# EAGLE schematic shieldRelayV2 (EAGLE 9.6.2)

## Sheet 1 of 3
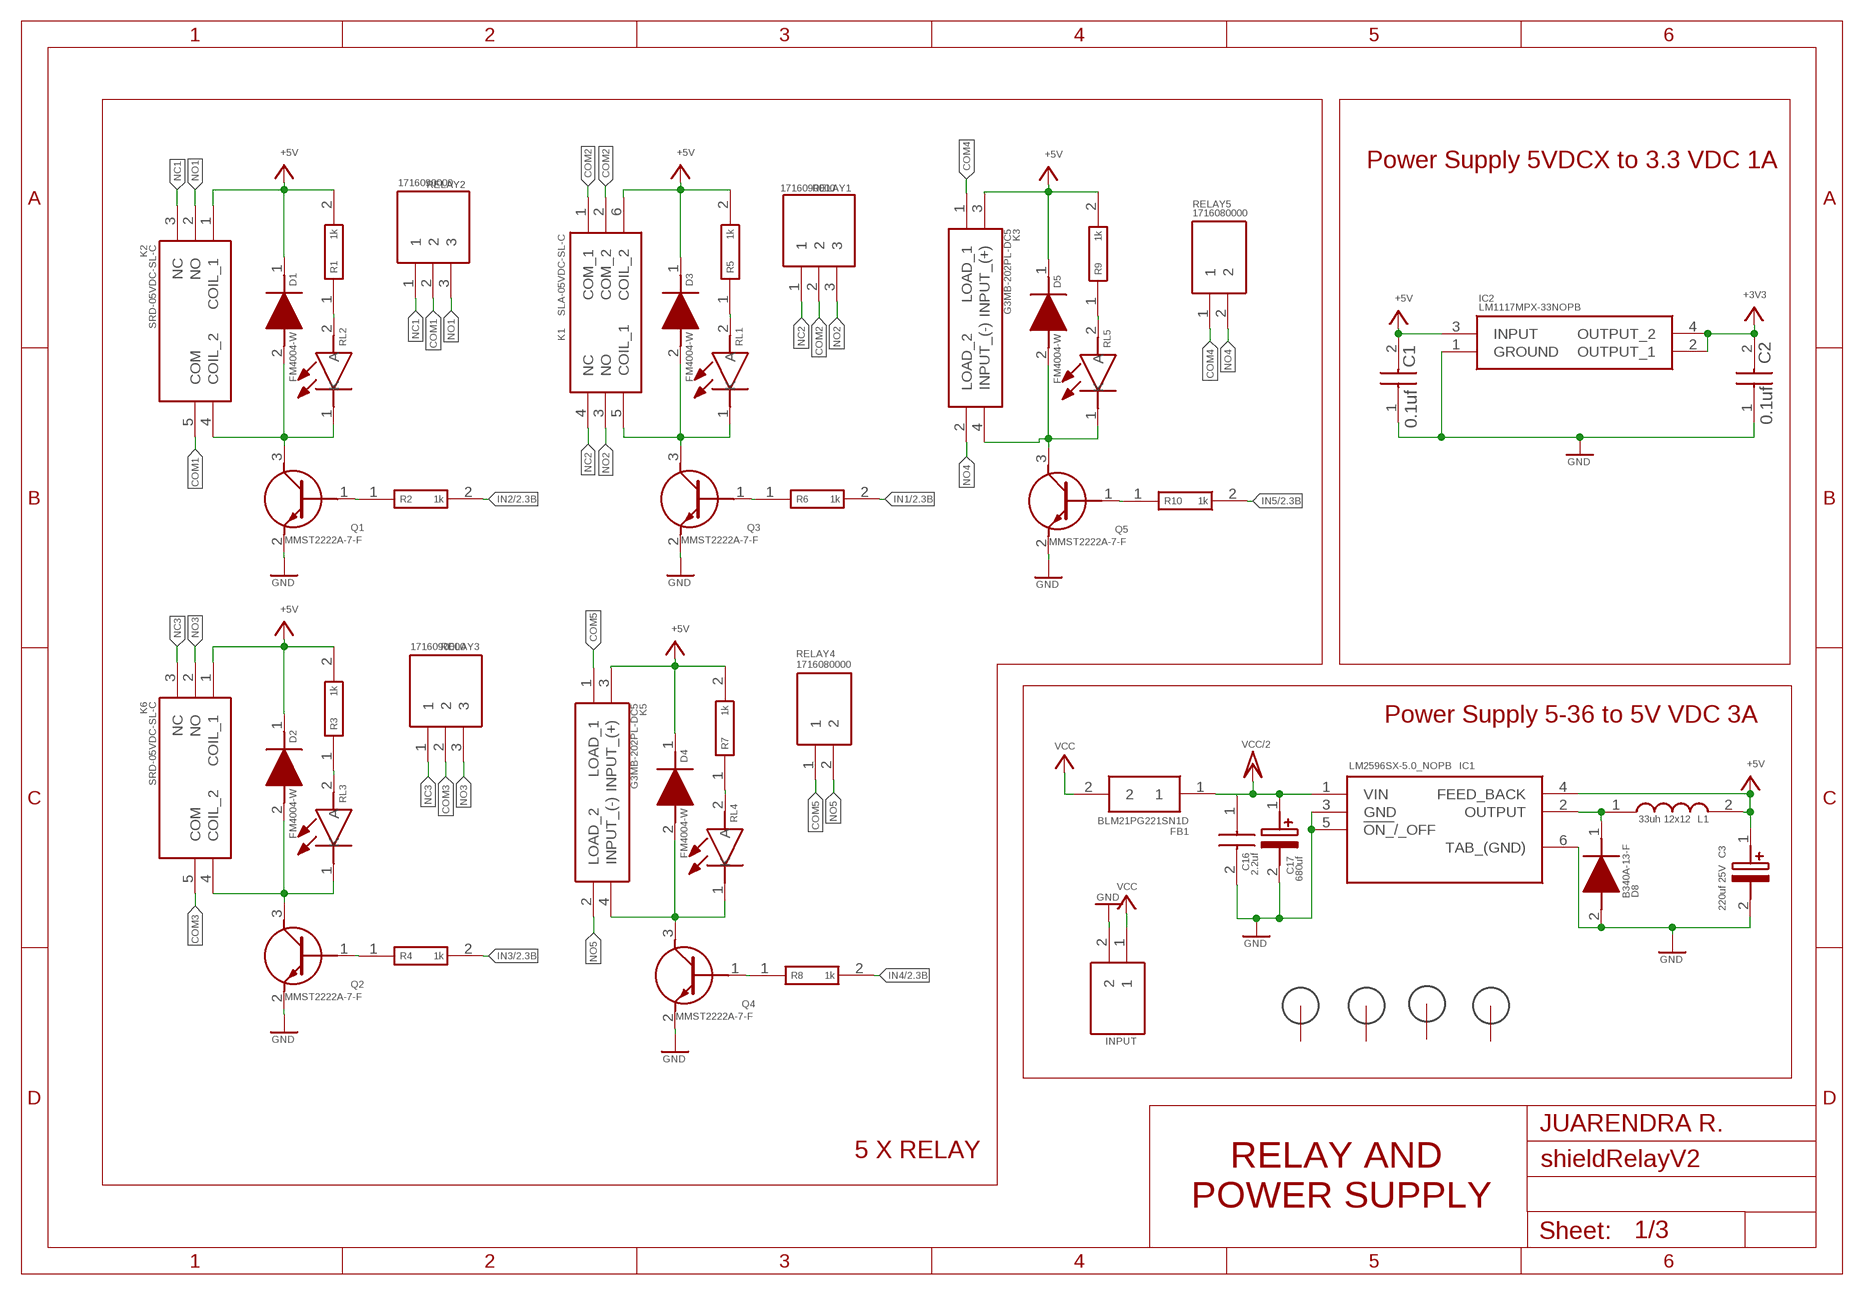
[diagram p0: schematic, sheet 1]

### Parts
C1  0.1uf  KGM15BR71E104KT  [CAPC1608X95N]
C2  0.1uf  KGM15BR71E104KT  [CAPC1608X95N]
C3  220uf 25V  MAL203836221E3  [CAPPRD350W60D850H1250]
C16  2.2uf  KAF21KR71H225KU  [CAPC2012X140N]
C17  680uf  EEH-ZU1V681UP  [EEHZS1H221P]
D1  FM4004-W  [DIONM5025X231N]
D2  FM4004-W  [DIONM5025X231N]
D3  FM4004-W  [DIONM5025X231N]
D4  FM4004-W  [DIONM5025X231N]
D5  FM4004-W  [DIONM5025X231N]
D8  B340A-13-F  [DIOM5226X240N]
FB1  BLM21PG221SN1D  [BEADC2012X105N]
H1  3MM_HOLE  [3MM_HOLE]
H2  3MM_HOLE  [3MM_HOLE]
H3  3MM_HOLE  [3MM_HOLE]
H4  3MM_HOLE  [3MM_HOLE]
IC1  LM2596SX-5.0_NOPB  [KTT0005B]
IC2  LM1117MPX-33NOPB  [SOT230P700X180-4N]
INPUT  1759017  [SHDRRA2W103P0X508_1X2_1016X120]
K1  SLA-05VDC-SL-C  [SLA05VDCSLC]
K2  SRD-05VDC-SL-C  [SRD05VDCSLC]
K3  G3MB-202PL-DC5  [G3MB202PLDC5]
K5  G3MB-202PL-DC5  [G3MB202PLDC5]
K6  SRD-05VDC-SL-C  [SRD05VDCSLC]
L1  33uh 12x12  744770133  [WE-PD_1260/1245/1280/121054]
Q1  MMST2222A-7-F  [SOT65P210X110-3N]
Q2  MMST2222A-7-F  [SOT65P210X110-3N]
Q3  MMST2222A-7-F  [SOT65P210X110-3N]
Q4  MMST2222A-7-F  [SOT65P210X110-3N]
Q5  MMST2222A-7-F  [SOT65P210X110-3N]
R1  1k  ERA-3AED102V  [ERA3AEB101V]
R2  1k  ERA-3AED102V  [ERA3AEB101V]
R3  1k  ERA-3AED102V  [ERA3AEB101V]
R4  1k  ERA-3AED102V  [ERA3AEB101V]
R5  1k  ERA-3AED102V  [ERA3AEB101V]
R6  1k  ERA-3AED102V  [ERA3AEB101V]
R7  1k  ERA-3AED102V  [ERA3AEB101V]
R8  1k  ERA-3AED102V  [ERA3AEB101V]
R9  1k  ERA-3AED102V  [ERA3AEB101V]
R10  1k  ERA-3AED102V  [ERA3AEB101V]
RELAY1  1716090000  [SHDR3W95P0X508_1X3_1524X1000X1]
RELAY2  1716090000  [SHDR3W95P0X508_1X3_1524X1000X1]
RELAY3  1716090000  [SHDR3W95P0X508_1X3_1524X1000X1]
RELAY4  1716080000  [1716080000]
RELAY5  1716080000  [1716080000]
RL1  150080SS75000  [LEDC2012X80N]
RL2  150080SS75000  [LEDC2012X80N]
RL3  150080SS75000  [LEDC2012X80N]
RL4  150080SS75000  [LEDC2012X80N]
RL5  150080SS75000  [LEDC2012X80N]

### Nets
+3V3: C2.2 IC2.2(OUTPUT_1) IC2.4(OUTPUT_2) ; also sheet 2,3
+5V: C1.2 C3.1(+) D1.1(K) D2.1(K) D3.1(K) D4.1(K) D5.1(K) IC1.4(FEED_BACK) IC2.3(INPUT) K1.6(COIL_2) K2.1(COIL_1) K3.3(INPUT_(+)) K5.3(INPUT_(+)) K6.1(COIL_1) L1.2 R1.2 R3.2 R5.2 R7.2 R9.2 ; also sheet 2,3
COM1: K2.5(COM) RELAY2.2
COM2: K1.1(COM_1) K1.2(COM_2) RELAY1.2
COM3: K6.5(COM) RELAY3.2
COM4: K3.1(LOAD_1) RELAY5.1
COM5: K5.1(LOAD_1) RELAY4.1
GND: C1.1 C2.1 C3.2(-) C16.2 C17.2(-) D8.2(A) IC1.3(GND) IC1.5(!ON_!/_OFF) IC1.6(TAB_(GND)) IC2.1(GROUND) INPUT.2 Q1.2(E) Q2.2(E) Q3.2(E) Q4.2(E) Q5.2(E) ; also sheet 2,3
IN1: R6.2 ; also sheet 2
IN2: R2.2 ; also sheet 2
IN3: R4.2 ; also sheet 2
IN4: R8.2 ; also sheet 2
IN5: R10.2 ; also sheet 2
N$1: R3.1 RL3.2(A)
N$2: R1.1 RL2.2(A)
N$3: D1.2(A) K2.4(COIL_2) Q1.3(C) RL2.1(K)
N$4: Q2.1(B) R4.1
N$5: D2.2(A) K6.4(COIL_2) Q2.3(C) RL3.1(K)
N$7: R5.1 RL1.2(A)
N$8: D3.2(A) K1.5(COIL_1) Q3.3(C) RL1.1(K)
N$9: Q1.1(B) R2.1
N$10: R7.1 RL4.2(A)
N$11: D4.2(A) K5.4(INPUT_(-)) Q4.3(C) RL4.1(K)
N$12: Q4.1(B) R8.1
N$13: R9.1 RL5.2(A)
N$14: D5.2(A) K3.4(INPUT_(-)) Q5.3(C) RL5.1(K)
N$15: Q3.1(B) R6.1
N$18: D8.1(K) IC1.2(OUTPUT) L1.1
N$23: Q5.1(B) R10.1
NC1: K2.3(NC) RELAY2.1
NC2: K1.4(NC) RELAY1.1
NC3: K6.3(NC) RELAY3.1
NO1: K2.2(NO) RELAY2.3
NO2: K1.3(NO) RELAY1.3
NO3: K6.2(NO) RELAY3.3
NO4: K3.2(LOAD_2) RELAY5.2
NO5: K5.2(LOAD_2) RELAY4.2
VCC: FB1.2 INPUT.1
VCC/2: C16.1 C17.1(+) FB1.1 IC1.1(VIN) ; also sheet 2
Unconnected: H1.P$1(GND) H1.P$2(GND) H1.P$3(GND) H1.P$4(GND) H1.P$5(GND) H1.P$6(GND) H1.P$7(GND) H1.P$8(GND) H1.P$9(GND) H2.P$1(GND) H2.P$2(GND) H2.P$3(GND) H2.P$4(GND) H2.P$5(GND) H2.P$6(GND) H2.P$7(GND) H2.P$8(GND) H2.P$9(GND) H3.P$1(GND) H3.P$2(GND) H3.P$3(GND) H3.P$4(GND) H3.P$5(GND) H3.P$6(GND) H3.P$7(GND) H3.P$8(GND) H3.P$9(GND) H4.P$1(GND) H4.P$2(GND) H4.P$3(GND) H4.P$4(GND) H4.P$5(GND) H4.P$6(GND) H4.P$7(GND) H4.P$8(GND) H4.P$9(GND)

### Notes on the sheet
- Power Supply 5VDCX to 3.3 VDC 1A
- Power Supply 5-36 to 5V VDC 3A
- JUARENDRA R.
- 5 X RELAY
- RELAY AND 
  POWER SUPPLY

## Sheet 2 of 3
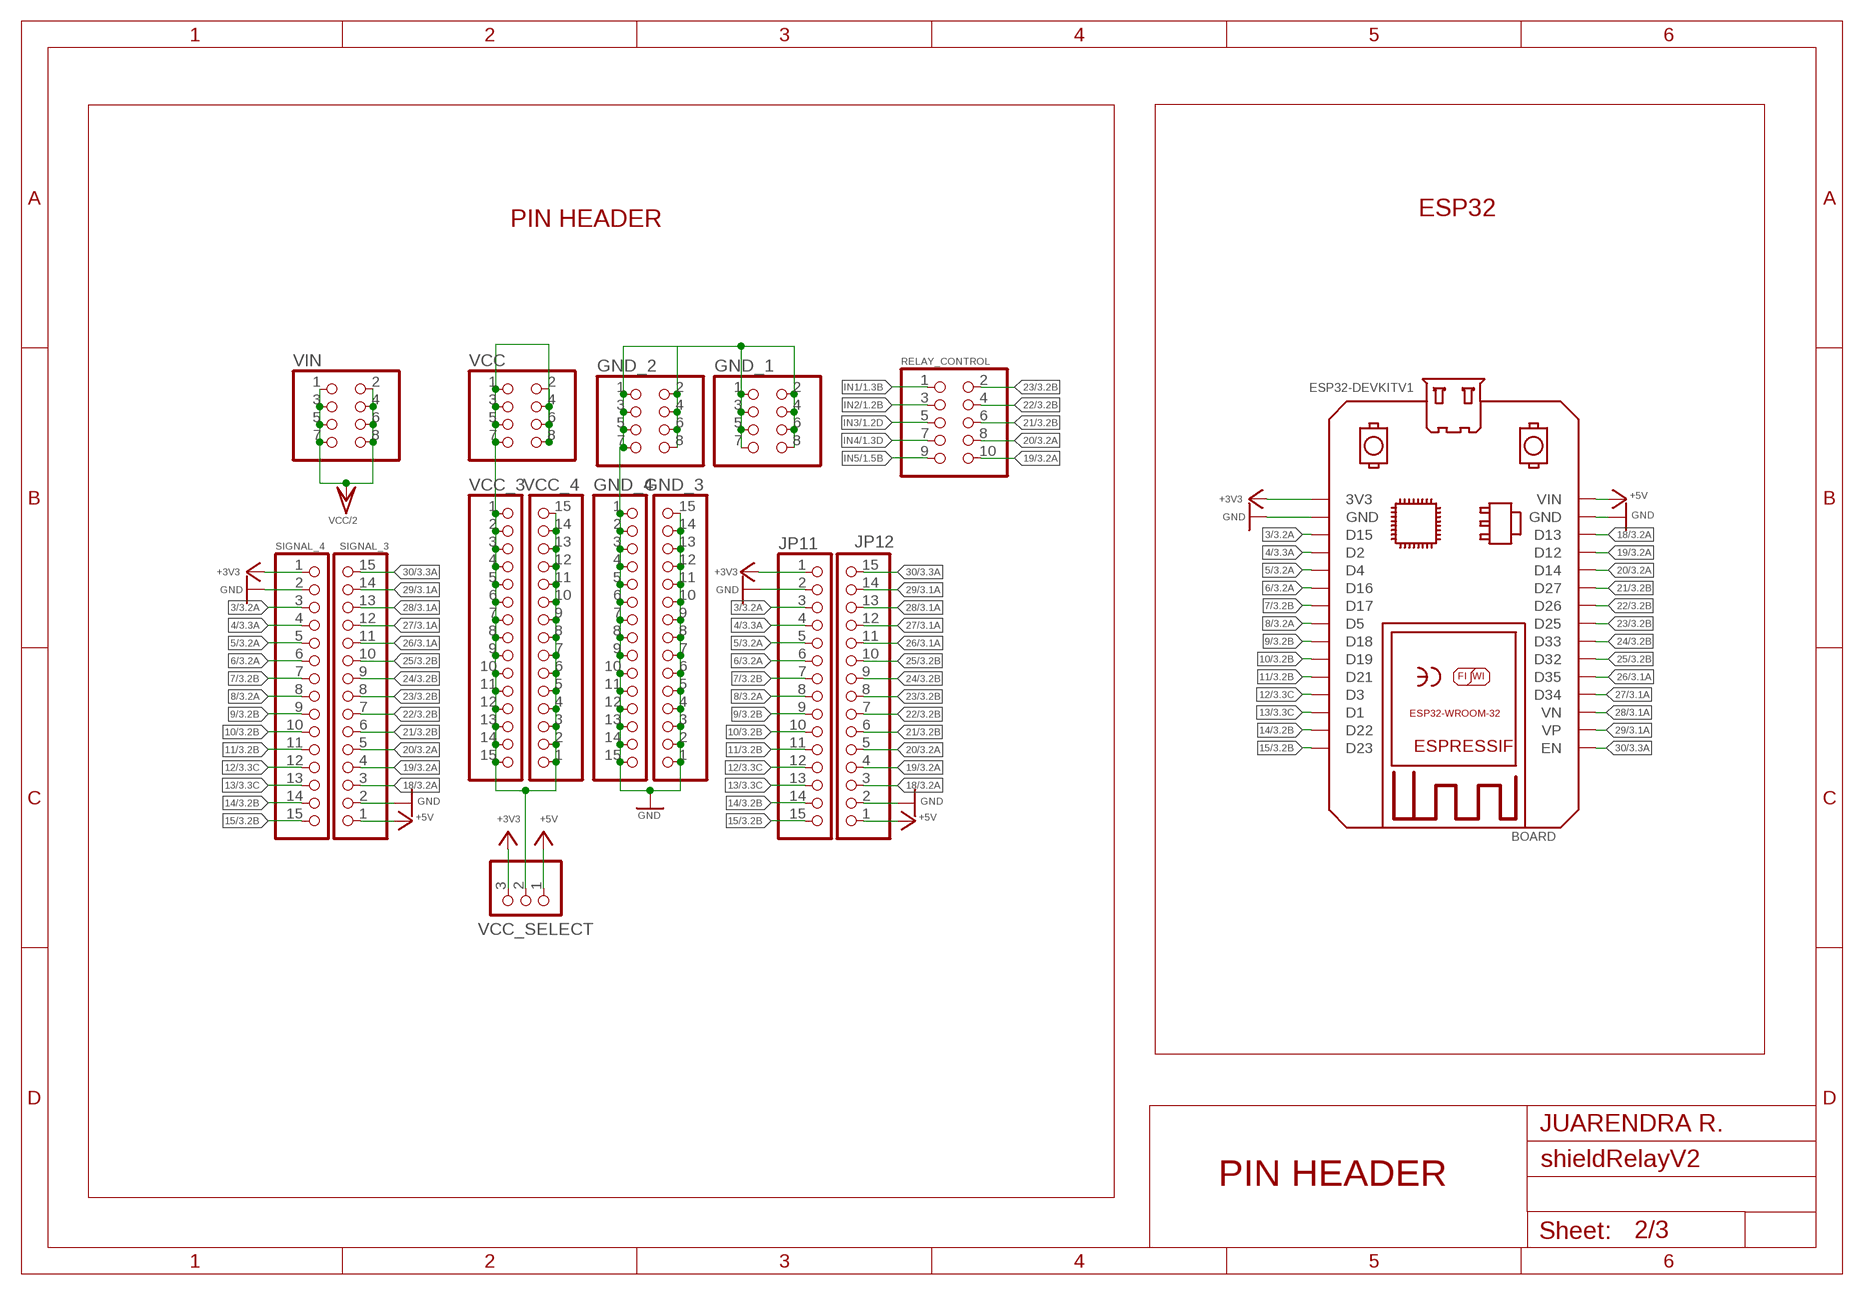
[diagram p1: schematic, sheet 2]

### Parts
BOARD  ESP32DEVKITV1  [ESP32-DEVKITV1]
GND_1  PINHD-2X4  [2X04]
GND_2  PINHD-2X4  [2X04]
GND_3  PINHD-1X15  [1X15]
GND_4  PINHD-1X15  [1X15]
JP11  PINHD-1X15  [1X15]
JP12  PINHD-1X15  [1X15]
RELAY_CONTROL  PINHD-2X5  [2X05]
SIGNAL_3  PINHD-1X15  [1X15]
SIGNAL_4  PINHD-1X15  [1X15]
VCC  PINHD-2X4  [2X04]
VCC_3  PINHD-1X15  [1X15]
VCC_4  PINHD-1X15  [1X15]
VCC_SELECT  PINHD-1X3  [1X03]
VIN  PINHD-2X4  [2X04]

### Nets
3: BOARD.D15 JP11.3 SIGNAL_4.3 ; also sheet 3
4: BOARD.D2 JP11.4 SIGNAL_4.4 ; also sheet 3
5: BOARD.D4 JP11.5 SIGNAL_4.5 ; also sheet 3
6: BOARD.D16 JP11.6 SIGNAL_4.6 ; also sheet 3
7: BOARD.D17 JP11.7 SIGNAL_4.7 ; also sheet 3
8: BOARD.D5 JP11.8 SIGNAL_4.8 ; also sheet 3
9: BOARD.D18 JP11.9 SIGNAL_4.9 ; also sheet 3
10: BOARD.D19 JP11.10 SIGNAL_4.10 ; also sheet 3
11: BOARD.D21 JP11.11 SIGNAL_4.11 ; also sheet 3
12: BOARD.D3 JP11.12 SIGNAL_4.12 ; also sheet 3
13: BOARD.D1 JP11.13 SIGNAL_4.13 ; also sheet 3
14: BOARD.D22 JP11.14 SIGNAL_4.14 ; also sheet 3
15: BOARD.D23 JP11.15 SIGNAL_4.15 ; also sheet 3
18: BOARD.D13 JP12.3 SIGNAL_3.3 ; also sheet 3
19: BOARD.D12 JP12.4 RELAY_CONTROL.10 SIGNAL_3.4 ; also sheet 3
20: BOARD.D14 JP12.5 RELAY_CONTROL.8 SIGNAL_3.5 ; also sheet 3
21: BOARD.D27 JP12.6 RELAY_CONTROL.6 SIGNAL_3.6 ; also sheet 3
22: BOARD.D26 JP12.7 RELAY_CONTROL.4 SIGNAL_3.7 ; also sheet 3
23: BOARD.D25 JP12.8 RELAY_CONTROL.2 SIGNAL_3.8 ; also sheet 3
24: BOARD.D33 JP12.9 SIGNAL_3.9 ; also sheet 3
25: BOARD.D32 JP12.10 SIGNAL_3.10 ; also sheet 3
26: BOARD.D35 JP12.11 SIGNAL_3.11 ; also sheet 3
27: BOARD.D34 JP12.12 SIGNAL_3.12 ; also sheet 3
28: BOARD.VN JP12.13 SIGNAL_3.13 ; also sheet 3
29: BOARD.VP JP12.14 SIGNAL_3.14 ; also sheet 3
30: BOARD.EN JP12.15 SIGNAL_3.15 ; also sheet 3
+3V3: BOARD.3V3 JP11.1 SIGNAL_4.1 VCC_SELECT.3 ; also sheet 1,3
+5V: BOARD.VIN JP12.1 SIGNAL_3.1 VCC_SELECT.1 ; also sheet 1,3
GND: BOARD.GND BOARD.GND@1(GND) GND_1.1 GND_1.2 GND_1.3 GND_1.4 GND_1.5 GND_1.6 GND_1.7 GND_1.8 GND_2.1 GND_2.2 GND_2.3 GND_2.4 GND_2.5 GND_2.6 GND_2.7 GND_2.8 GND_3.1 GND_3.2 GND_3.3 GND_3.4 GND_3.5 GND_3.6 GND_3.7 GND_3.8 GND_3.9 GND_3.10 GND_3.11 GND_3.12 GND_3.13 GND_3.14 GND_3.15 GND_4.1 GND_4.2 GND_4.3 GND_4.4 GND_4.5 GND_4.6 GND_4.7 GND_4.8 GND_4.9 GND_4.10 GND_4.11 GND_4.12 GND_4.13 GND_4.14 GND_4.15 JP11.2 JP12.2 SIGNAL_3.2 SIGNAL_4.2 ; also sheet 1,3
IN1: RELAY_CONTROL.1 ; also sheet 1
IN2: RELAY_CONTROL.3 ; also sheet 1
IN3: RELAY_CONTROL.5 ; also sheet 1
IN4: RELAY_CONTROL.7 ; also sheet 1
IN5: RELAY_CONTROL.9 ; also sheet 1
N$39: VCC.1 VCC.2 VCC.3 VCC.4 VCC.5 VCC.6 VCC.7 VCC.8 VCC_3.1 VCC_3.2 VCC_3.3 VCC_3.4 VCC_3.5 VCC_3.6 VCC_3.7 VCC_3.8 VCC_3.9 VCC_3.10 VCC_3.11 VCC_3.12 VCC_3.13 VCC_3.14 VCC_3.15 VCC_4.1 VCC_4.2 VCC_4.3 VCC_4.4 VCC_4.5 VCC_4.6 VCC_4.7 VCC_4.8 VCC_4.9 VCC_4.10 VCC_4.11 VCC_4.12 VCC_4.13 VCC_4.14 VCC_4.15 VCC_SELECT.2
VCC/2: VIN.1 VIN.2 VIN.3 VIN.4 VIN.5 VIN.6 VIN.7 VIN.8 ; also sheet 1

### Notes on the sheet
- ESP32
- PIN HEADER
- JUARENDRA R.
- PIN HEADER

## Sheet 3 of 3
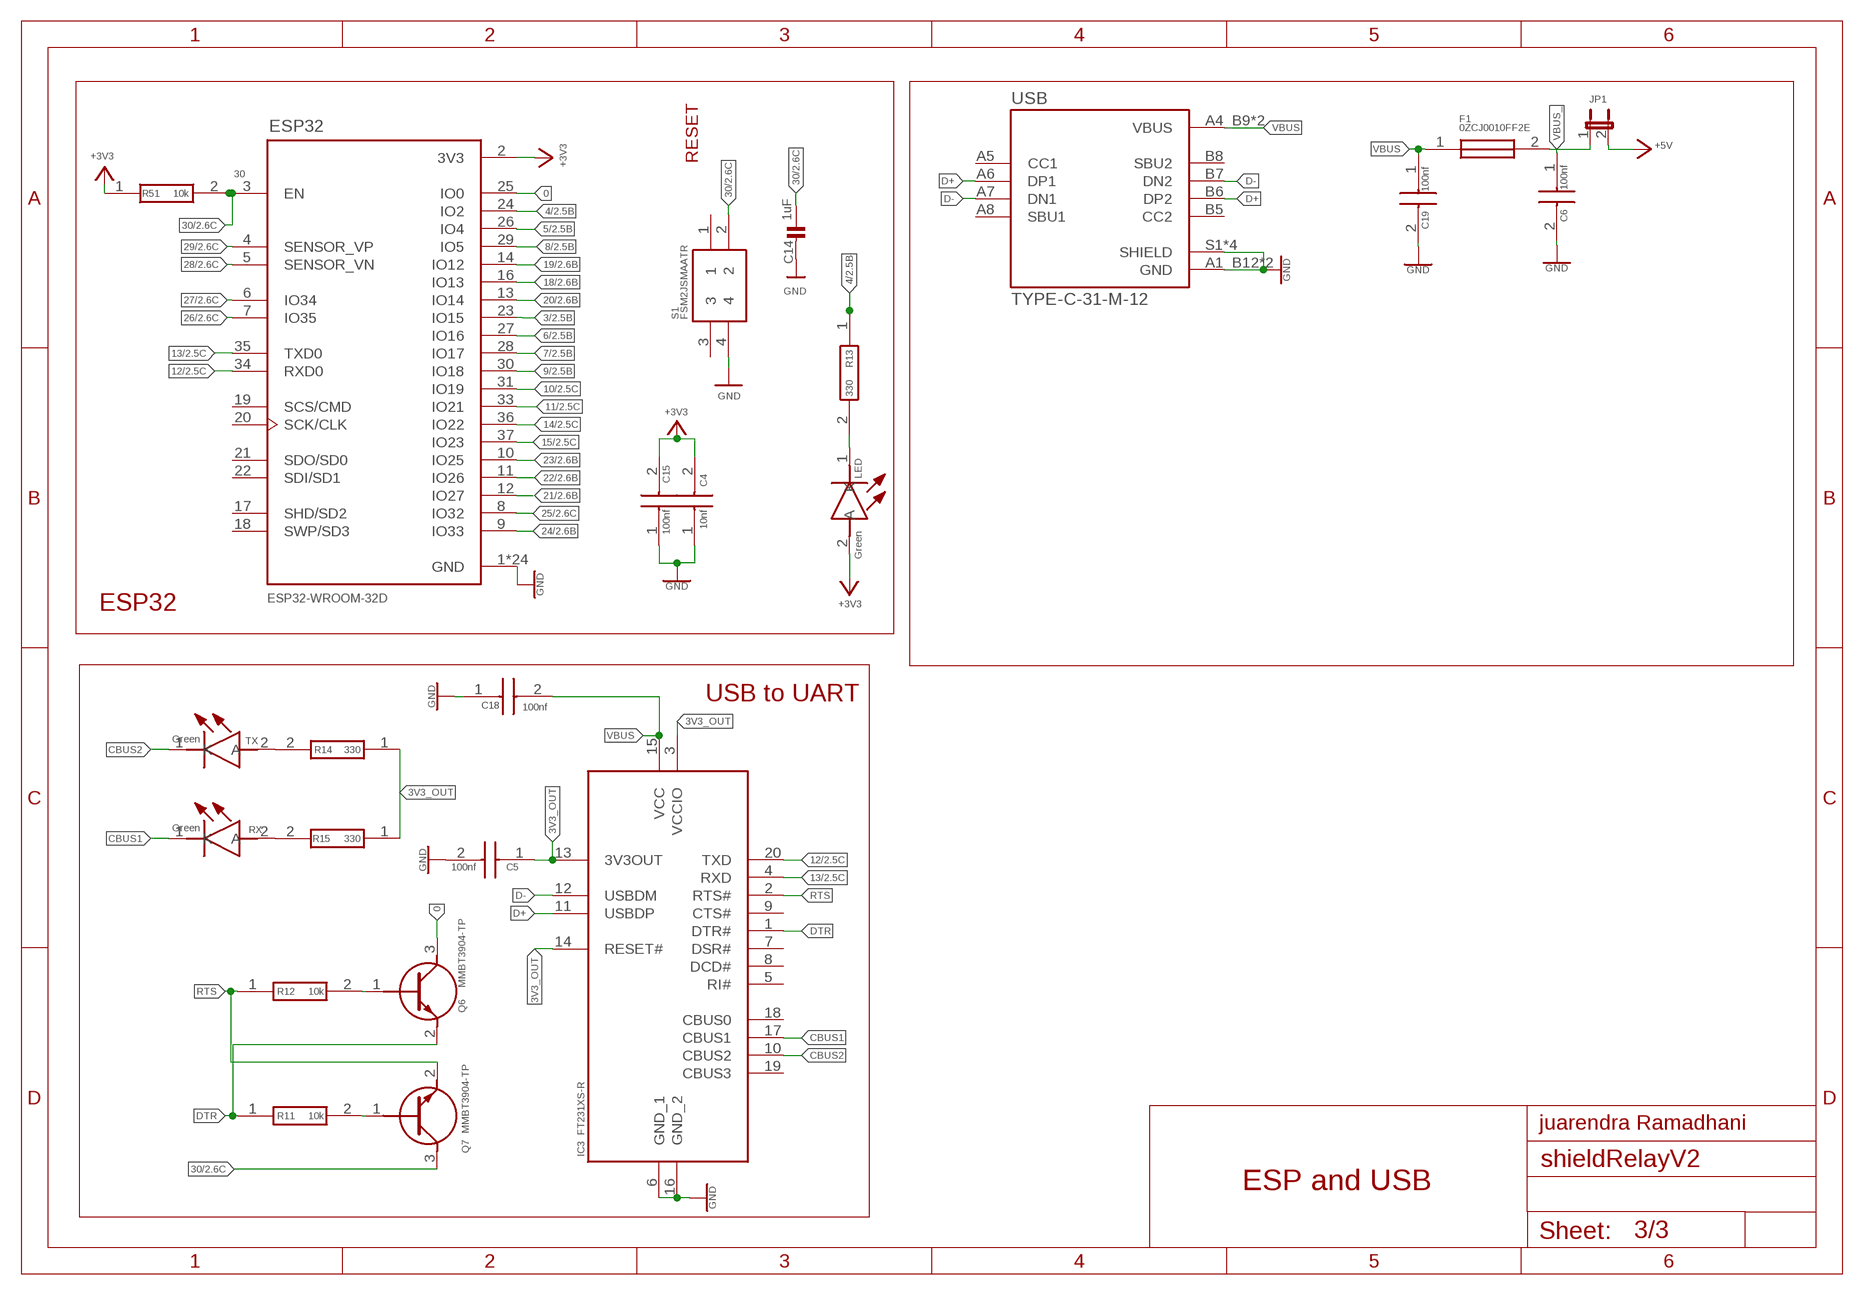
[diagram p2: schematic, sheet 3]

### Parts
C4  10nf  885012206089  [CAPC1608X87N]
C5  100nf  885012206071  [CAPC1608X87N]
C6  100nf  885012206071  [CAPC1608X87N]
C14  1uF  CAP_CERAMIC0603  [0603]
C15  100nf  885012206071  [CAPC1608X87N]
C18  100nf  885012206071  [CAPC1608X87N]
C19  100nf  885012206071  [CAPC1608X87N]
ESP32  ESP32-WROOM-32D  [MODULE_ESP32-WROOM-32D]
F1  0ZCJ0010FF2E  [FUSC3216X75N]
IC3  FT231XS-R  [SOP64P599X175-20N]
JP1  JP1E  [JP1]
LED  Green  150080BS75000  [LEDC2012X80N]
Q6  MMBT3904-TP  [SI2305TP]
Q7  MMBT3904-TP  [SI2305TP]
R11  10k  ESR03EZPJ103  [RESC1608X55N]
R12  10k  ESR03EZPJ103  [RESC1608X55N]
R13  330  ERJ-H3EF3300V  [ERJH3]
R14  330  ERJ-H3EF3300V  [ERJH3]
R15  330  ERJ-H3EF3300V  [ERJH3]
R51  10k  ESR03EZPJ103  [RESC1608X55N]
RX  Green  150080BS75000  [LEDC2012X80N]
S1  FSM2JSMAATR  [FSM2J_1]
TX  Green  150080BS75000  [LEDC2012X80N]
USB  TYPE-C-31-M-12  [HRO_TYPE-C-31-M-12]

### Nets
0: ESP32.25(IO0) Q6.3(C)
3: ESP32.23(IO15) ; also sheet 2
3V3_OUT: C5.1 IC3.3(VCCIO) IC3.13(3V3OUT) IC3.14(RESET#) R14.1 R15.1
4: ESP32.24(IO2) R13.1 ; also sheet 2
5: ESP32.26(IO4) ; also sheet 2
6: ESP32.27(IO16) ; also sheet 2
7: ESP32.28(IO17) ; also sheet 2
8: ESP32.29(IO5) ; also sheet 2
9: ESP32.30(IO18) ; also sheet 2
10: ESP32.31(IO19) ; also sheet 2
11: ESP32.33(IO21) ; also sheet 2
12: ESP32.34(RXD0) IC3.20(TXD) ; also sheet 2
13: ESP32.35(TXD0) IC3.4(RXD) ; also sheet 2
14: ESP32.36(IO22) ; also sheet 2
15: ESP32.37(IO23) ; also sheet 2
18: ESP32.16(IO13) ; also sheet 2
19: ESP32.14(IO12) ; also sheet 2
20: ESP32.13(IO14) ; also sheet 2
21: ESP32.12(IO27) ; also sheet 2
22: ESP32.11(IO26) ; also sheet 2
23: ESP32.10(IO25) ; also sheet 2
24: ESP32.9(IO33) ; also sheet 2
25: ESP32.8(IO32) ; also sheet 2
26: ESP32.7(IO35) ; also sheet 2
27: ESP32.6(IO34) ; also sheet 2
28: ESP32.5(SENSOR_VN) ; also sheet 2
29: ESP32.4(SENSOR_VP) ; also sheet 2
30: C14.1 ESP32.3(EN) Q7.3(C) R51.2 S1.2 ; also sheet 2
+3V3: C4.2 C15.2 ESP32.2(3V3) LED.2(A) R51.1 ; also sheet 1,2
+5V: JP1.2 ; also sheet 1,2
CBUS1: IC3.17(CBUS1) RX.1(K)
CBUS2: IC3.10(CBUS2) TX.1(K)
D+: IC3.11(USBDP) USB.A6(DP1) USB.B6(DP2)
D-: IC3.12(USBDM) USB.A7(DN1) USB.B7(DN2)
DTR: IC3.1(DTR#) Q6.2(E) R11.1
GND: C4.1 C5.2 C6.2 C14.2 C15.1 C18.1 C19.2 IC3.6(GND_1) IC3.16(GND_2) S1.4 USB.A1_B12(GND) USB.B1_A12(GND) USB.S1(SHIELD) USB.S2(SHIELD) USB.S3(SHIELD) USB.S4(SHIELD) ; also sheet 1,2
N$16: Q7.1(B) R11.2
N$17: Q6.1(B) R12.2
N$19: R15.2 RX.2(A)
N$20: R14.2 TX.2(A)
N$22: LED.1(K) R13.2
RTS: IC3.2(RTS#) Q7.2(E) R12.1
VBUS: C18.2 C19.1 F1.1 IC3.15(VCC) USB.A4_B9(VBUS) USB.B4_A9(VBUS)
VBUS_: C6.1 F1.2 JP1.1
Unconnected: ESP32.17(SHD/SD2) ESP32.18(SWP/SD3) ESP32.19(SCS/CMD) ESP32.20(SCK/CLK) ESP32.21(SDO/SD0) ESP32.22(SDI/SD1) IC3.5(RI#) IC3.7(DSR#) IC3.8(DCD#) IC3.9(CTS#) IC3.18(CBUS0) IC3.19(CBUS3) S1.1 S1.3 USB.A5(CC1) USB.A8(SBU1) USB.B5(CC2) USB.B8(SBU2)

### Notes on the sheet
- RESET
- ESP32
- USB to UART
- juarendra Ramadhani
- ESP and USB

## Power pins joined to a net without a drawn wire
GND: ESP32.1(GND) ESP32.15(GND) ESP32.38(GND) ESP32.39_1(GND) ESP32.39_2(GND) ESP32.39_3(GND) ESP32.39_4(GND) ESP32.39_5(GND) ESP32.39_6(GND) ESP32.39_7(GND) ESP32.39_8(GND) ESP32.39_9(GND) ESP32.39_10(GND) ESP32.39_11(GND) ESP32.39_12(GND) ESP32.39_13(GND) ESP32.39_14(GND) ESP32.39_15(GND) ESP32.39_16(GND) ESP32.39_17(GND) ESP32.39_18(GND) ESP32.39_19(GND) ESP32.39_20(GND) ESP32.39_21(GND)

## Library data of the parts
BOARD = ESP32-DEVKITV1:ESP32DEVKITV1: https://github.com/shridattdudhat
C1 C2 = KGM15BR71E104KT:KGM15BR71E104KT: 0603 25 V X7R 100nF +/-10% Source: Datasheet <https://spicat.kyocera-avx.com/product/mlcc/chartview/KGM15BR71E104KT>; DESCRIPTION: 0603 25 V X7R 100nF +/-10%; HEIGHT: 0.95mm; MANUFACTURER_NAME: Kyocera AVX; MANUFACTURER_PART_NUMBER: KGM15BR71E104KT; MOUSER_PART_NUMBER: 581-KGM15BR71E104KT; MOUSER_PRICE-STOCK: https://www.mouser.co.uk/ProductDetail/KYOCERA-AVX/KGM15BR71E104KT?qs=Jm2GQyTW%2FbiCo%2Fby4Q068Q%3D%3D
C3 = MAL203836221E3:MAL203836221E3: VISHAY - MAL203836221E3 - CAP, 220F, 25V, 20% Source: Datasheet; DESCRIPTION: VISHAY - MAL203836221E3 - CAP, 220F, 25V, 20%; HEIGHT: 12.5mm; MANUFACTURER_NAME: Vishay; MANUFACTURER_PART_NUMBER: MAL203836221E3; MOUSER_PART_NUMBER: 594-MAL203836221E3; MOUSER_PRICE-STOCK: https://www.mouser.co.uk/ProductDetail/Vishay-BC-Components/MAL203836221E3?qs=G99oyVYclWUIwcN6B3qC5w%3D%3D
C4 = AccesControlNFC:885012206089: Wurth Elektronik 0603 WCAP-CSGP 10nF Ceramic Multilayer Capacitor, 50 V dc, +125C, X7R Dielectric, +/-10% Source: Datasheet <https://katalog.we-online.com/pbs/datasheet/885012206089.pdf>; DESCRIPTION: Wurth Elektronik 0603 WCAP-CSGP 10nF Ceramic Multilayer Capacitor, 50 V dc, +125C, X7R Dielectric, +/-10%; DIGIKEY_PARTNUMBER: 732-8007-1-ND; DIGIKEY_PRICE-STOCK: https://www.digikey.com/product-detail/en/w%C3%BCrth-elektronik/885012206089/732-8007-1-ND/5454634; HEIGHT: 0.87mm; MANUFACTURER_NAME: Wurth Elektronik; MANUFACTURER_PART_NUMBER: 885012206089; MOUSER_PART_NUMBER: 710-885012206089; MOUSER_PRICE-STOCK: https://www.mouser.co.uk/ProductDetail/Wurth-Elektronik/885012206089?qs=0KOYDY2FL28GvSbKh319Tw%3D%3D
C5 C6 C15 C18 C19 = AccesControlNFC:885012206071: Wurth Elektronik 0603 WCAP-CSGP 100nF Ceramic Multilayer Capacitor, 25 V dc, +125C, X7R Dielectric, +/-10% Source: Datasheet <https://katalog.we-online.com/pbs/datasheet/885012206071.pdf>; DESCRIPTION: Wurth Elektronik 0603 WCAP-CSGP 100nF Ceramic Multilayer Capacitor, 25 V dc, +125C, X7R Dielectric, +/-10%; DIGIKEY_PARTNUMBER: 732-7989-1-ND; DIGIKEY_PRICE-STOCK: https://www.digikey.com/product-detail/en/w%C3%BCrth-elektronik/885012206071/732-7989-1-ND/5454616; HEIGHT: 0.87mm; MANUFACTURER_NAME: Wurth Elektronik; MANUFACTURER_PART_NUMBER: 885012206071; MOUSER_PART_NUMBER: 710-885012206071; MOUSER_PRICE-STOCK: https://www.mouser.co.uk/ProductDetail/Wurth-Elektronik/885012206071?qs=0KOYDY2FL2%2FEBQkuHgvarg%3D%3D
C14 = microbuilder:CAP_CERAMIC: Ceramic Capacitors 0402 - 0402 Surface Mount Capacitors 16pF 50V 5% [Digikey: 445-4899-2-ND] 18pF 50V 5% [Digikey: 490-1281-2-ND] 22pF 50V 5% [Digikey: 490-1283-2-ND] 68pF 50V 5% [Digikey: 490-1289-2-ND] 0.1uF 10V 10% [Digikey: 490-1318-2-ND] 1.0uF 6.3V 10% [Digikey: 490-1320-2-ND] 0603 - 0603 Surface Mount Capacitors 16 pF 50V 5% [Digikey: 445-5051-2-ND] 22 pF 50V [Digikey: PCC220ACVTR-ND] 33 pF 50V 5% [Digikey: 490-1415-1-ND] 56pF 50V 5% [Digikey: 490-1421-1-ND] 220pF 50V 5% [Digikey: 445-1285-1-ND] 680 pF 50V 2200 pF 50V 5% C0G [Digikey: 445-1297-1-ND] 5600 pF 100V 5% X7R [Digikey: 478-3711-1-ND] 0.1 µF 25V 10% [Digikey: PCC2277TR-ND] 0.22 µF 16V 10% X7R [Digikey: 445-1318-1-ND] 1.0 µF 25V 10% [Digikey: 445-5146-2-ND] 0603 - RF Specific 3pF 250V +/-0.1pF RF [Digikey: 712-1347-1-ND] 18 pF 250V 5% [Digikey: 478-3505-1-ND or 712-1322-1-ND] 56 pF 250V 5% C0G RF [Digikey: 490-4867-1-ND] 68 pF 250V RF [Digikey: 490-4868-1-ND] 0805 - 0805 Surface Mount Capacitors 220 pF 250V 2% RF Ceramic Capacitor [Digikey: 712-1398-1-ND] 1000 pF 50V 2% NP0 Ceramic Capacitor [Digikey: 478-3760-1-ND] 0.1 µF 25V 10% Ceramic Capacitor [Digikey: PCC1828TR-ND] 1.0 µF 16V 10% Ceramic Capacitor[Digikey: 490-1691-2-ND] 10.0 µF 10V 10% Ceramic Capacitor[Digikey: 709-1228-1-ND] 10.0 uF 16V 10% Ceramic Capacitor [Digikey: 478-5165-2-ND] 47 uF 6.3V 20% Ceramic Capacitor [Digikey: 587-1779-1-ND or 399-5506-1-ND] 1206 - 1206 Surface Mount Capacitors 47uF 10V 20% Ceramic Capacitor [Digikey: 490-5528-1-ND or 399-5508-1-ND or 445-6010-1-ND] 100uF 6.3V -20%, +80% Y5V Ceramic Capacitor (Digikey: 490-4512-1-ND, Mouser: 81-GRM31CF50J107ZE1L)
C16 = KAF21KR71H225KU:KAF21KR71H225KU: Multilayer Ceramic Capacitors MLCC - SMD/SMT 50V 2.2uF X7R 0805 10% AEC-Q200 FLEXITERM Source: Datasheet <https://datasheets.kyocera-avx.com/AutoMLCCKAF.pdf>; DESCRIPTION: Multilayer Ceramic Capacitors MLCC - SMD/SMT 50V 2.2uF X7R 0805 10% AEC-Q200 FLEXITERM; HEIGHT: 1.4mm; MANUFACTURER_NAME: Kyocera AVX; MANUFACTURER_PART_NUMBER: KAF21KR71H225KU; MOUSER_PART_NUMBER: 581-KAF21KR71H225KU; MOUSER_PRICE-STOCK: https://www.mouser.co.uk/ProductDetail/KYOCERA-AVX/KAF21KR71H225KU?qs=Jm2GQyTW%2FbjwwNTLmtUMeQ%3D%3D
C17 = EEH-ZU1V681UP:EEH-ZU1V681UP: Conductive Polymer Hybrid Aluminum Electrolytic Capacitor Source: Datasheet <https://industrial.panasonic.com/cdbs/www-data/pdf/RDD0000/ast-ind-280898.pdf>; DESCRIPTION: Conductive Polymer Hybrid Aluminum Electrolytic Capacitor; HEIGHT: 10.5mm; MANUFACTURER_NAME: Panasonic; MANUFACTURER_PART_NUMBER: EEH-ZU1V681UP; MOUSER_PART_NUMBER: 667-EEH-ZU1V681UP; MOUSER_PRICE-STOCK: https://www.mouser.co.uk/ProductDetail/Panasonic/EEH-ZU1V681UP?qs=HoCaDK9Nz5elLexP3akqig%3D%3D
D1-D5 = FM4004-W:FM4004-W: Rectifiers 1N4004 1A 400V Source: Datasheet <https://componentsearchengine.com/Datasheets/1/FM4004-W.pdf>; DESCRIPTION: Rectifiers 1N4004 1A 400V; HEIGHT: 2.31mm; MANUFACTURER_NAME: Rectron; MANUFACTURER_PART_NUMBER: FM4004-W; MOUSER_PART_NUMBER: 583-FM4004; MOUSER_PRICE-STOCK: https://www.mouser.co.uk/ProductDetail/Rectron/FM4004-W?qs=Iw9Ubr57Px3IHNH1bE4l9w%3D%3D
D8 = B340A-13-F:B340A-13-F: Schottky Diode 3A 40V 0.5Vf SMA Diodes Inc B340A-13-F, SMT Schottky Diode, 40V 3A, 2-Pin DO-214AC Source: Datasheet <https://datasheet.datasheetarchive.com/originals/distributors/Datasheets-305/73551.pdf>; DESCRIPTION: Schottky Diode 3A 40V 0.5Vf SMA Diodes Inc B340A-13-F, SMT Schottky Diode, 40V 3A, 2-Pin DO-214AC; HEIGHT: 2.4mm; MANUFACTURER_NAME: Diodes Incorporated; MANUFACTURER_PART_NUMBER: B340A-13-F; MOUSER_PART_NUMBER: 621-B340A-F; MOUSER_PRICE-STOCK: https://www.mouser.co.uk/ProductDetail/Diodes-Incorporated/B340A-13-F?qs=aLaTXeBcTP9fj%2FYKVo6Q1A%3D%3D
ESP32 = AccesControlNFC:ESP32-WROOM-32D: Bluetooth, WiFi 802.11b/g/n, Bluetooth v4.2 + EDR, Class 1, 2 and 3 Transceiver Module 2.4GHz ~ 2.5GHz Integrated, Trace Surface Mount Check availability <https://pricing.snapeda.com/parts/ESP32-WROOM-32D/Espressif%20Systems/view-part?ref=eda>; AVAILABILITY: In Stock; DESCRIPTION: Bluetooth, WiFi 802.11b/g/n, Bluetooth v4.2 +EDR, Class 1, 2 and 3 Transceiver Module 2.4GHz ~ 2.5GHz Integrated; MF: Espressif Systems; MP: ESP32-WROOM-32D; PACKAGE: Module Espressif Systems; PRICE: None; PURCHASE-URL: https://pricing.snapeda.com/search/part/ESP32-WROOM-32D/?ref=eda
F1 = 0ZCJ0010FF2E:0ZCJ0010FF2E: Resettable Fuses - PPTC Fuse Source: Datasheet <https://componentsearchengine.com/Datasheets/1/0ZCJ0010FF2E.pdf>; DESCRIPTION: Resettable Fuses - PPTC Fuse; HEIGHT: 0.75mm; MANUFACTURER_NAME: BelFuse; MANUFACTURER_PART_NUMBER: 0ZCJ0010FF2E; MOUSER_PART_NUMBER: 530-0ZCJ0010FF2E; MOUSER_PRICE-STOCK: https://www.mouser.co.uk/ProductDetail/Bel-Fuse/0ZCJ0010FF2E?qs=SRYZG9HaIQ2ZPdy0ahZ08g%3D%3D
FB1 = BLM21PG221SN1D:BLM21PG221SN1D: Murata Ferrite Bead (Chip Ferrite Bead), 2 x 1.25 x 0.85mm Source: Datasheet <https://datasheet.datasheetarchive.com/originals/dk/DKDS-31/605570.pdf>; DESCRIPTION: Murata Ferrite Bead (Chip Ferrite Bead), 2 x 1.25 x 0.85mm; HEIGHT: 1.05mm; MANUFACTURER_NAME: Murata Electronics; MANUFACTURER_PART_NUMBER: BLM21PG221SN1D; MOUSER_PART_NUMBER: 81-BLM21P221SG; MOUSER_PRICE-STOCK: https://www.mouser.co.uk/ProductDetail/Murata-Electronics/BLM21PG221SN1D?qs=N%2FLoXOA9PTJ4i6RHFrsqmw%3D%3D
GND_1 GND_2 VCC VIN = pinhead:PINHD-2X4: PIN HEADER
GND_3 GND_4 JP11 JP12 SIGNAL_3 SIGNAL_4 VCC_3 VCC_4 = pinhead_mod:PINHD-1X15: PIN HEADER
H1-H4 = 3mm_special_hole:3MM_HOLE: Cool looking 3mm hole with ground connection
IC1 = LM2596SX-5.0_NOPB:LM2596SX-5.0_NOPB: SIMPLE SWITCHER® 4.5V to 40V, 3A Low Component Count Step-Down Regulator Source: Datasheet <http://www.ti.com/lit/gpn/lm2596>; DESCRIPTION: SIMPLE SWITCHER&#174; 4.5V to 40V, 3A Low Component Count Step-Down Regulator; HEIGHT: mm; MANUFACTURER_NAME: Texas Instruments; MANUFACTURER_PART_NUMBER: LM2596SX-5.0/NOPB; MOUSER_PART_NUMBER: 926-LM2596SX-5.0NOPB; MOUSER_PRICE-STOCK: https://www.mouser.co.uk/ProductDetail/Texas-Instruments/LM2596SX-5.0-NOPB?qs=X1J7HmVL2ZGZ5T4VcWdmNw%3D%3D
IC2 = LM1117MPX-33NOPB:LM1117MPX-33NOPB: LDO Voltage Regulators 800-mA 15-V linear voltage regulator 800-mA 15-V linear voltage regulator Source: Datasheet <https://www.arrow.com/en/products/lm1117mpx-33nopb/on-semiconductor>; DESCRIPTION: LDO Voltage Regulators 800-mA 15-V linear voltage regulator 800-mA 15-V linear voltage regulator; HEIGHT: 1.8mm; MANUFACTURER_NAME: onsemi; MANUFACTURER_PART_NUMBER: LM1117MPX-33NOPB; MOUSER_PART_NUMBER: 863-LM1117MPX-33NOPB; MOUSER_PRICE-STOCK: https://www.mouser.co.uk/ProductDetail/onsemi/LM1117MPX-33NOPB?qs=DPoM0jnrROUIbzbQHFmeig%3D%3D
IC3 = AccesControlNFC:FT231XS-R: FTDI Chip FT231XS-R, Interface RS232, RS422, RS485, SIE, UART 3MBd, 5 V, 20-pin, SSOP Source: Datasheet; DESCRIPTION: FTDI Chip FT231XS-R, Interface RS232, RS422, RS485, SIE, UART 3MBd, 5 V, 20-pin, SSOP; HEIGHT: 1.753mm; MANUFACTURER_NAME: FTDI Chip; MANUFACTURER_PART_NUMBER: FT231XS-R; MOUSER_PART_NUMBER: 895-FT231XS-R; MOUSER_PRICE-STOCK: https://www.mouser.co.uk/ProductDetail/FTDI/FT231XS-R?qs=Gp1Yz1mis3WduRPsgrTbtg%3D%3D
INPUT = 1759017:1759017: PCB header, nominal cross section: 2.5 mm?, color: green, nominal current: 12 A, rated voltage (III/2): 320 V, contact surface: Tin, type of contact: Male connector, Number of potentials: 2, Number of rows: 1, Number of positions per row: 2, number of connections: 2, product range: MSTB 2,5/..-G, pitch: 5.08 mm, mounting: Wave soldering, pin layout: Linear pinning, solder pin [P]: 3.5 mm, Stecksystem: CLASSIC COMBICON, Locking: without, type of packaging: packed in cardboard Source: Datasheet <http://www.phoenixcontact.com/de/produkte/1759017/pdf>; DESCRIPTION: PCB header, nominal cross section: 2.5 mm?, color: green, nominal current: 12 A, rated voltage (III/2): 320 V, contact surface: Tin, type of contact: Male connector, Number of potentials: 2, Number of rows: 1, Number of positions per row: 2, number of connections: 2, product range: MSTB 2,5/..-G, pitch: 5.08 mm, mounting: Wave soldering, pin layout: Linear pinning, solder pin [P]: 3.5 mm, Stecksystem: CLASSIC COMBICON, Locking: without, type of packaging: packed in cardboard; HEIGHT: 8.72mm; MANUFACTURER_NAME: Phoenix Contact; MANUFACTURER_PART_NUMBER: 1759017; MOUSER_PART_NUMBER: 651-1759017; MOUSER_PRICE-STOCK: https://www.mouser.co.uk/ProductDetail/Phoenix-Contact/1759017?qs=BYlwlsDsB%2FoOYIHqYLxOcg%3D%3D
JP1 = jumper:JP1E: JUMPER
K1 = SLA-05VDC-SL-C:SLA-05VDC-SL-C: Relays General Purpose Non Latching 5VDC SPDT 30A (250VAC) Max Plugin RoHS Source: Datasheet <https://datasheet.lcsc.com/szlcsc/Ningbo-Songle-Relay-SLA-05VDC-SL-C_C87367.pdf>; DESCRIPTION: Relays General Purpose Non Latching 5VDC SPDT 30A (250VAC) Max Plugin RoHS; HEIGHT: 20.4mm; MANUFACTURER_NAME: Songle Relay; MANUFACTURER_PART_NUMBER: SLA-05VDC-SL-C
K2 K6 = SRD-05VDC-SL-C:SRD-05VDC-SL-C: SRD-05VDC-SL-C; RELAY ISO9002 1. MAIN FEATURES Switching capacity available by 10A in spite of small size design for highdensity P.C. board mounting technique. U Source: Datasheet <http://www.songlerelay.com/Public/Uploads/20161104/581c81ac16e36.pdf>; DESCRIPTION: SRD-05VDC-SL-C; RELAY ISO9002 1. MAIN FEATURES Switching capacity available by 10A in spite of small size design for highdensity P.C. board mounting technique. U; HEIGHT: 15.8mm; MANUFACTURER_NAME: EAGLE; MANUFACTURER_PART_NUMBER: SRD-05VDC-SL-C
K3 K5 = G3MB-202PL-DC5:G3MB-202PL-DC5: Solid State Relays - PCB Mount 5VDC/100-240VAC 2A Source: Datasheet <https://www.mouser.com/datasheet/2/307/g3mb_0609-1189645.pdf>; DESCRIPTION: Solid State Relays - PCB Mount 5VDC/100-240VAC 2A; HEIGHT: 20.5mm; MANUFACTURER_NAME: Omron Electronics; MANUFACTURER_PART_NUMBER: G3MB-202PL-DC5; MOUSER_PART_NUMBER: 653-G3MB-202PL-DC5; MOUSER_PRICE-STOCK: https://www.mouser.co.uk/ProductDetail/Omron-Automation-and-Safety/G3MB-202PL-DC5?qs=CX134%252BdLMDF4X9k4CH7R5g%3D%3D
L1 = 744770133:744770133: Wurth WE-PD Series Shielded Wire-wound SMD Inductor with a Ferrite Core, 33 uH +/-20% 3.6A Idc Source: Datasheet; DESCRIPTION: Wurth WE-PD Series Shielded Wire-wound SMD Inductor with a Ferrite Core, 33 uH +/-20% 3.6A Idc; HEIGHT: mm; MANUFACTURER_NAME: Wurth Elektronik; MANUFACTURER_PART_NUMBER: 744770133; MOUSER_PART_NUMBER: 710-744770133; MOUSER_PRICE-STOCK: https://www.mouser.co.uk/ProductDetail/Wurth-Elektronik/744770133?qs=E%2F%2FhvbtCqpPKkGJl8TxFXw%3D%3D
LED RX TX = AccesControlNFC:150080BS75000: LED,Wurth Elektronik,150080BS75000 Wurth Elektronik 150080BS75000, WL-SMCW Series Blue LED, 470 nm 2012 (0805) Clear, Rectangle Lens SMD package Source: Datasheet <https://katalog.we-online.com/led/datasheet/150080BS75000.pdf>; DESCRIPTION: LED,Wurth Elektronik,150080BS75000 Wurth Elektronik 150080BS75000, WL-SMCW Series Blue LED, 470 nm 2012 (0805) Clear, Rectangle Lens SMD package; HEIGHT: 0.8mm; MANUFACTURER_NAME: Wurth Elektronik; MANUFACTURER_PART_NUMBER: 150080BS75000; MOUSER_PART_NUMBER: 710-150080BS75000; MOUSER_PRICE-STOCK: https://www.mouser.co.uk/ProductDetail/Wurth-Elektronik/150080BS75000?qs=2kOmHSv6VfT2tBo3UPVqAQ%3D%3D
Q1-Q5 = MMST2222A-7-F:MMST2222A-7-F: Bipolar (BJT) Transistor NPN 40 V 600 mA 300MHz 200 mW Surface Mount SOT-323 Source: Datasheet <https://www.diodes.com/assets/Datasheets/ds30080.pdf>; DESCRIPTION: Bipolar (BJT) Transistor NPN 40 V 600 mA 300MHz 200 mW Surface Mount SOT-323; HEIGHT: 1.1mm; MANUFACTURER_NAME: Diodes Incorporated; MANUFACTURER_PART_NUMBER: MMST2222A-7-F; MOUSER_PART_NUMBER: 621-MMST2222A-F; MOUSER_PRICE-STOCK: https://www.mouser.co.uk/ProductDetail/Diodes-Incorporated/MMST2222A-7-F?qs=B0AElM0L7fPu4CagNNXsRQ%3D%3D
Q6 Q7 = AccesControlNFC:MMBT3904-TP: Bipolar Transistors - BJT 40V Source: Datasheet <https://componentsearchengine.com/Datasheets/1/MMBT3904-TP.pdf>; DESCRIPTION: Bipolar Transistors - BJT 40V; HEIGHT: mm; MANUFACTURER_NAME: Micro Commercial Components (MCC); MANUFACTURER_PART_NUMBER: MMBT3904-TP; MOUSER_PART_NUMBER: 833-MMBT3904-TP; MOUSER_PRICE-STOCK: https://www.mouser.co.uk/ProductDetail/Micro-Commercial-Components-MCC/MMBT3904-TP?qs=KFo7JewZbUHicjDjIayULQ%3D%3D
R1-R10 = ERA-3AED102V:ERA-3AED102V: Thin Film Resistors - SMD 0603 1000ohms 25ppm 0.5% AEC-Q200 Source: Datasheet <https://industrial.panasonic.com/cdbs/www-data/pdf/RDM0000/AOA0000C307.pdf>; DESCRIPTION: Thin Film Resistors - SMD 0603 1000ohms 25ppm 0.5% AEC-Q200; HEIGHT: 0.55mm; MANUFACTURER_NAME: Panasonic; MANUFACTURER_PART_NUMBER: ERA-3AED102V; MOUSER_PART_NUMBER: 667-ERA-3AED102V; MOUSER_PRICE-STOCK: https://www.mouser.co.uk/ProductDetail/Panasonic/ERA-3AED102V?qs=yocZuyCaXdNrh6oeFjCchg%3D%3D
R11 R12 R51 = AccesControlNFC:ESR03EZPJ103: Thick Film Resistors - SMD 0603 10Kohm 5% Anti Surge AEC-Q200 Source: Datasheet <https://componentsearchengine.com/Datasheets/1/ESR03EZPJ103.pdf>; DESCRIPTION: Thick Film Resistors - SMD 0603 10Kohm 5% Anti Surge AEC-Q200; DIGIKEY_PARTNUMBER: RHM10KDCT-ND; DIGIKEY_PRICE-STOCK: https://www.digikey.com/product-detail/en/rohm-semiconductor/ESR03EZPJ103/RHM10KDCT-ND/1762925; HEIGHT: 0.55mm; MANUFACTURER_NAME: ROHM Semiconductor; MANUFACTURER_PART_NUMBER: ESR03EZPJ103; MOUSER_PART_NUMBER: 755-ESR03EZPJ103; MOUSER_PRICE-STOCK: https://www.mouser.com/Search/Refine.aspx?Keyword=755-ESR03EZPJ103
R13-R15 = AccesControlNFC:ERJ-H3EF3300V: Power Rating 0.125W,Resistance 330 Ohm,LxW(EIA) 1.6 x 0.8 (EIA:0603) mm Source: Datasheet <http://industrial.panasonic.com/cdbs/www-data/pdf/RDQ0000/ast-ind-151033.pdf>; DESCRIPTION: Power Rating 0.125W,Resistance 330 Ohm,LxW(EIA) 1.6 x 0.8 (EIA:0603) mm; HEIGHT: mm; MANUFACTURER_NAME: Panasonic; MANUFACTURER_PART_NUMBER: ERJ-H3EF3300V; MOUSER_PART_NUMBER: 667-ERJ-H3EF3300V; MOUSER_PRICE-STOCK: https://www.mouser.co.uk/ProductDetail/Panasonic/ERJ-H3EF3300V?qs=eP2BKZSCXI61roRLPi8W7w%3D%3D
RELAY1-RELAY3 = 1716090000:1716090000: Printed circuit board terminals, 5.08 mm, Number of poles: 3, 90, Solder pin length: 3.5 mm, tinned, orange, Clamping yoke connection, Clamping range, max. [rated connection]: 2.5 mm, Box Source: Datasheet <http://catalog.weidmueller.com/createDatasheetForMobile.do?ordernumber=1716090000&scope1=1&scope2=1&localeId=en>; DESCRIPTION: Printed circuit board terminals, 5.08 mm, Number of poles: 3, 90, Solder pin length: 3.5 mm, tinned, orange, Clamping yoke connection, Clamping range, max. [rated connection]: 2.5 mm, Box; HEIGHT: 13.8mm; MANUFACTURER_NAME: Weidmuller; MANUFACTURER_PART_NUMBER: 1716090000; MOUSER_PART_NUMBER: 470-1716090000; MOUSER_PRICE-STOCK: https://www.mouser.co.uk/ProductDetail/Weidmuller/1716090000?qs=BTG2th8YmhRwtiTHzuCKAQ%3D%3D
RELAY4 RELAY5 = 1716080000:1716080000: Printed circuit board terminals, 5.08 mm, Number of poles: 2, 90, Solder pin length: 3.5 mm, tinned, orange, Clamping yoke connection, Clamping range, max. [rated connection]: 2.5 mm, Box Source: Datasheet <http://catalog.weidmueller.com/createDatasheetForMobile.do?ordernumber=1716080000&scope1=1&scope2=1&localeId=en>; DESCRIPTION: Printed circuit board terminals, 5.08 mm, Number of poles: 2, 90, Solder pin length: 3.5 mm, tinned, orange, Clamping yoke connection, Clamping range, max. [rated connection]: 2.5 mm, Box; HEIGHT: 13.8mm; MANUFACTURER_NAME: Weidmuller; MANUFACTURER_PART_NUMBER: 1716080000; MOUSER_PART_NUMBER: 470-1716080000; MOUSER_PRICE-STOCK: https://www.mouser.co.uk/ProductDetail/Weidmuller/1716080000?qs=BTG2th8YmhQnu8ZhPH6LgQ%3D%3D
RELAY_CONTROL = pinhead:PINHD-2X5: PIN HEADER
RL1-RL5 = SamacSys_Parts:150080SS75000: Wurth Elektronik 150080SS75000, WL-SMCW Series Red LED, 630 nm, 2012 (0805) Clear, Rectangle Lens SMD Package Source: Datasheet <https://katalog.we-online.com/led/datasheet/150080SS75000.pdf>; DESCRIPTION: Wurth Elektronik 150080SS75000, WL-SMCW Series Red LED, 630 nm, 2012 (0805) Clear, Rectangle Lens SMD Package; DIGIKEY_PARTNUMBER: 732-4985-1-ND; DIGIKEY_PRICE-STOCK: https://www.digikey.com/product-detail/en/w%C3%BCrth-elektronik/150080SS75000/732-4985-1-ND/4489919; HEIGHT: 0.8mm; MANUFACTURER_NAME: Wurth Elektronik; MANUFACTURER_PART_NUMBER: 150080SS75000; MOUSER_PART_NUMBER: 710-150080SS75000; MOUSER_PRICE-STOCK: https://www.mouser.co.uk/ProductDetail/Wurth-Elektronik/150080SS75000?qs=LlUlMxKIyB2zzpiaOzrUdw%3D%3D
S1 = FSM2JSMAATR:FSM2JSMAATR: Tactile switch,SMT,SPST,raised white act Source: Datasheet <http://www.te.com/commerce/DocumentDelivery/DDEController?Action=showdoc&DocId=Customer Drawing2-1437565-7VpdfEnglishENG_CD_2-1437565-7_V.pdf2-1437565-9>; DESCRIPTION: Tactile switch,SMT,SPST,raised white act; HEIGHT: mm; MANUFACTURER_NAME: TE Connectivity; MANUFACTURER_PART_NUMBER: FSM2JSMAATR; MOUSER_PART_NUMBER: 506-FSM2JSMAATR; MOUSER_PRICE-STOCK: https://www.mouser.co.uk/ProductDetail/TE-Connectivity-Alcoswitch/FSM2JSMAATR?qs=g%252BEszo6zu8MKdISiZRITCQ%3D%3D
USB = TYPE-C-31-M-12:TYPE-C-31-M-12: Check availability <https://pricing.snapeda.com/parts/TYPE-C-31-M-12/HRO%20Electronics%20Co.%2C%20Ltd./view-part?ref=eda>; AVAILABILITY: Not in stock; CHECK_PRICES: https://www.snapeda.com/parts/TYPE-C-31-M-12/HRO+Electronics+Co.%252C+Ltd./view-part/?ref=eda; DESCRIPTION: USB Connectors 24 Receptacle 1 8.94*7.3mm RoHS; MF: HRO Electronics Co., Ltd.; MP: TYPE-C-31-M-12; PACKAGE: Package; PRICE: None; SNAPEDA_LINK: https://www.snapeda.com/parts/TYPE-C-31-M-12/HRO+Electronics+Co.%252C+Ltd./view-part/?ref=snap
VCC_SELECT = pinhead:PINHD-1X3: PIN HEADER